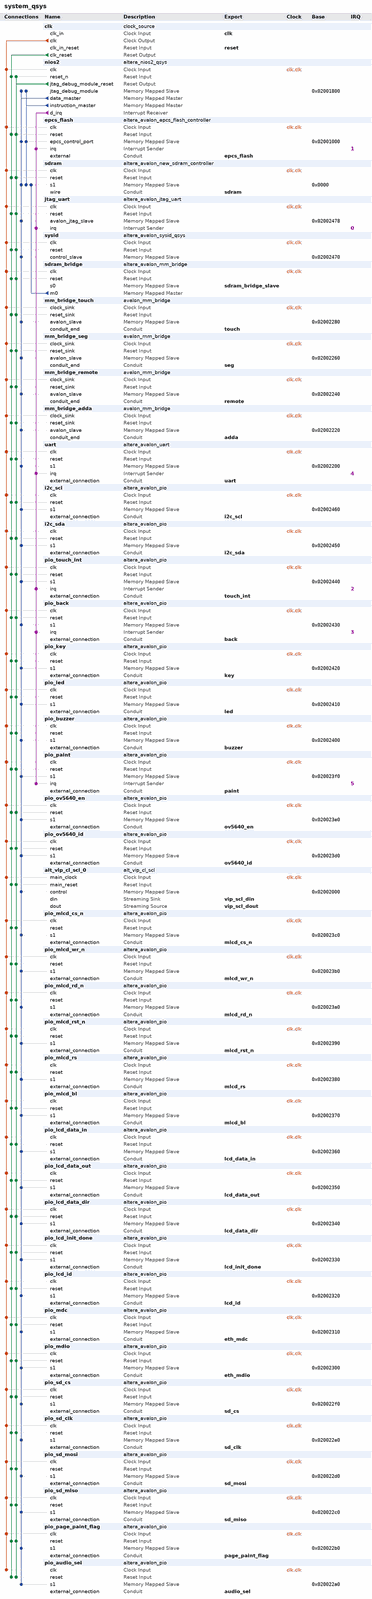
[diagram p0: system contents, whole]
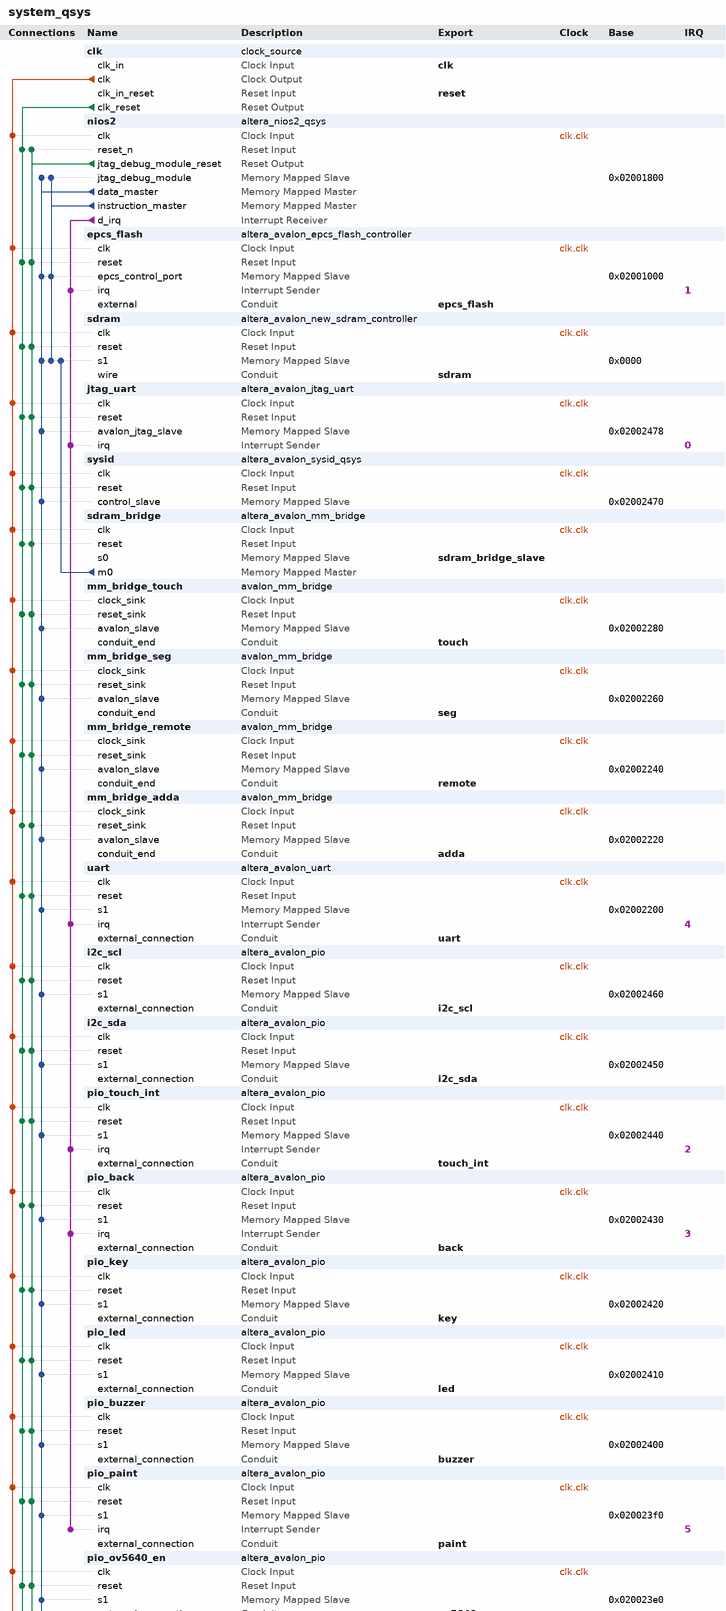
[diagram p1: system contents, upper part]
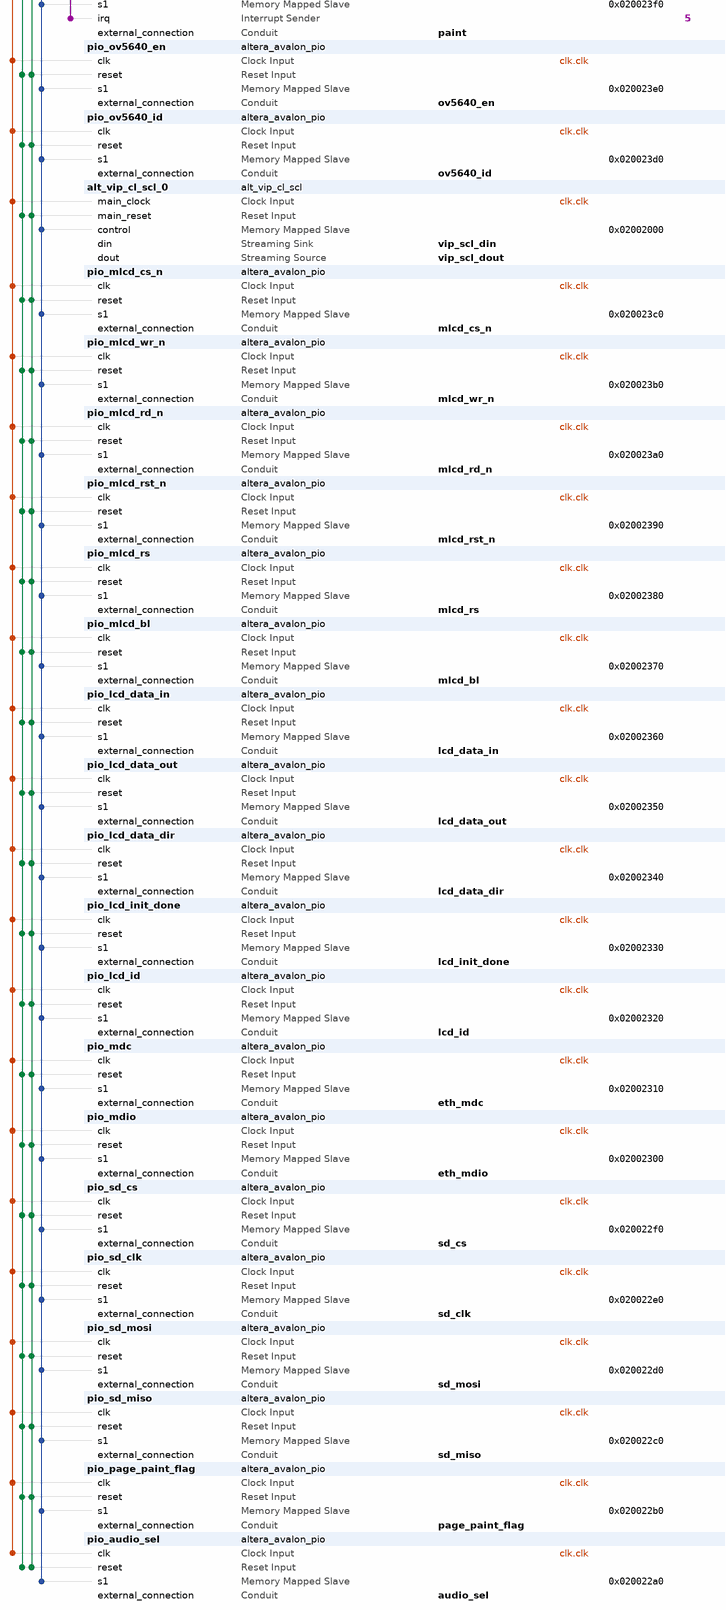
[diagram p2: system contents, lower part]
# Platform Designer (Qsys) system system_qsys, Cyclone IV E EP4CE10F17C8
# Parameters at their usual value, and those the tool derives, are not listed.
package require -exact qsys 13.1
create_system system_qsys
set_project_property DEVICE_FAMILY {Cyclone IV E}
set_project_property DEVICE EP4CE10F17C8

add_instance clk clock_source 13.1
set_instance_parameter_value clk clockFrequency 100000000

add_instance nios2 altera_nios2_qsys 13.1
set_instance_parameter_value nios2 resetSlave epcs_flash.epcs_control_port
set_instance_parameter_value nios2 mmu_TLBMissExcSlave None
set_instance_parameter_value nios2 exceptionSlave sdram.s1
set_instance_parameter_value nios2 breakSlave nios2.jtag_debug_module
set_instance_parameter_value nios2 impl Fast
set_instance_parameter_value nios2 icache_size 4096

add_instance epcs_flash altera_avalon_epcs_flash_controller 13.1

add_instance sdram altera_avalon_new_sdram_controller 13.1
set_instance_parameter_value sdram TAC 6.0
set_instance_parameter_value sdram TRCD 15.0
set_instance_parameter_value sdram TRFC 60.0
set_instance_parameter_value sdram TRP 15.0
set_instance_parameter_value sdram TWR 20.0
set_instance_parameter_value sdram casLatency 2
set_instance_parameter_value sdram columnWidth 9
set_instance_parameter_value sdram dataWidth 16
set_instance_parameter_value sdram generateSimulationModel false
set_instance_parameter_value sdram initRefreshCommands 8
set_instance_parameter_value sdram model single_Micron_MT48LC4M32B2_7_chip
set_instance_parameter_value sdram numberOfBanks 4
set_instance_parameter_value sdram numberOfChipSelects 1
set_instance_parameter_value sdram powerUpDelay 200.0
set_instance_parameter_value sdram refreshPeriod 7.8125
set_instance_parameter_value sdram rowWidth 13

add_instance jtag_uart altera_avalon_jtag_uart 13.1
set_instance_parameter_value jtag_uart simInteractiveOptions NO_INTERACTIVE_WINDOWS

add_instance sysid altera_avalon_sysid_qsys 13.1
set_instance_parameter_value sysid id 0

add_instance sdram_bridge altera_avalon_mm_bridge 13.1
set_instance_parameter_value sdram_bridge DATA_WIDTH 16
set_instance_parameter_value sdram_bridge ADDRESS_WIDTH 26
set_instance_parameter_value sdram_bridge ADDRESS_UNITS SYMBOLS
set_instance_parameter_value sdram_bridge MAX_BURST_SIZE 512
set_instance_parameter_value sdram_bridge MAX_PENDING_RESPONSES 4

add_instance mm_bridge_touch avalon_mm_bridge 1.0
set_instance_parameter_value mm_bridge_touch width 3

add_instance mm_bridge_seg avalon_mm_bridge 1.0
set_instance_parameter_value mm_bridge_seg width 3

add_instance mm_bridge_remote avalon_mm_bridge 1.0
set_instance_parameter_value mm_bridge_remote width 3

add_instance mm_bridge_adda avalon_mm_bridge 1.0
set_instance_parameter_value mm_bridge_adda width 3

add_instance uart altera_avalon_uart 13.1
set_instance_parameter_value uart baud 115200
set_instance_parameter_value uart dataBits 8
set_instance_parameter_value uart fixedBaud true
set_instance_parameter_value uart parity NONE
set_instance_parameter_value uart stopBits 1

add_instance i2c_scl altera_avalon_pio 13.1
set_instance_parameter_value i2c_scl direction Output
set_instance_parameter_value i2c_scl width 1

add_instance i2c_sda altera_avalon_pio 13.1
set_instance_parameter_value i2c_sda direction Bidir
set_instance_parameter_value i2c_sda width 1

add_instance pio_touch_int altera_avalon_pio 13.1
set_instance_parameter_value pio_touch_int bitClearingEdgeCapReg true
set_instance_parameter_value pio_touch_int captureEdge true
set_instance_parameter_value pio_touch_int direction Input
set_instance_parameter_value pio_touch_int edgeType FALLING
set_instance_parameter_value pio_touch_int generateIRQ true
set_instance_parameter_value pio_touch_int irqType EDGE
set_instance_parameter_value pio_touch_int width 1

add_instance pio_back altera_avalon_pio 13.1
set_instance_parameter_value pio_back bitClearingEdgeCapReg true
set_instance_parameter_value pio_back captureEdge true
set_instance_parameter_value pio_back direction Input
set_instance_parameter_value pio_back generateIRQ true
set_instance_parameter_value pio_back irqType EDGE
set_instance_parameter_value pio_back width 1

add_instance pio_key altera_avalon_pio 13.1
set_instance_parameter_value pio_key direction Input
set_instance_parameter_value pio_key width 4

add_instance pio_led altera_avalon_pio 13.1
set_instance_parameter_value pio_led direction Output
set_instance_parameter_value pio_led width 4

add_instance pio_buzzer altera_avalon_pio 13.1
set_instance_parameter_value pio_buzzer direction Output
set_instance_parameter_value pio_buzzer width 1

add_instance pio_paint altera_avalon_pio 13.1
set_instance_parameter_value pio_paint captureEdge true
set_instance_parameter_value pio_paint direction Input
set_instance_parameter_value pio_paint edgeType FALLING
set_instance_parameter_value pio_paint generateIRQ true
set_instance_parameter_value pio_paint irqType EDGE
set_instance_parameter_value pio_paint width 1

add_instance pio_ov5640_en altera_avalon_pio 13.1
set_instance_parameter_value pio_ov5640_en direction Output
set_instance_parameter_value pio_ov5640_en width 1

add_instance pio_ov5640_id altera_avalon_pio 13.1
set_instance_parameter_value pio_ov5640_id direction Input
set_instance_parameter_value pio_ov5640_id width 1

add_instance alt_vip_cl_scl_0 alt_vip_cl_scl 13.1
set_instance_parameter_value alt_vip_cl_scl_0 FAMILY {Cyclone IV E}
set_instance_parameter_value alt_vip_cl_scl_0 SYMBOLS_IN_SEQ 1
set_instance_parameter_value alt_vip_cl_scl_0 SYMBOLS_IN_PAR 3
set_instance_parameter_value alt_vip_cl_scl_0 BITS_PER_SYMBOL 8
set_instance_parameter_value alt_vip_cl_scl_0 EXTRA_PIPELINING 0
set_instance_parameter_value alt_vip_cl_scl_0 IS_422 0
set_instance_parameter_value alt_vip_cl_scl_0 NO_BLANKING 1
set_instance_parameter_value alt_vip_cl_scl_0 MAX_IN_WIDTH 800
set_instance_parameter_value alt_vip_cl_scl_0 MAX_IN_HEIGHT 480
set_instance_parameter_value alt_vip_cl_scl_0 MAX_OUT_WIDTH 1280
set_instance_parameter_value alt_vip_cl_scl_0 MAX_OUT_HEIGHT 800
set_instance_parameter_value alt_vip_cl_scl_0 RUNTIME_CONTROL 1
set_instance_parameter_value alt_vip_cl_scl_0 ALWAYS_DOWNSCALE 0
set_instance_parameter_value alt_vip_cl_scl_0 ALGORITHM_NAME NEAREST_NEIGHBOUR
set_instance_parameter_value alt_vip_cl_scl_0 DEFAULT_EDGE_THRESH 7
set_instance_parameter_value alt_vip_cl_scl_0 DEFAULT_UPPER_BLUR 15
set_instance_parameter_value alt_vip_cl_scl_0 DEFAULT_LOWER_BLUR 0
set_instance_parameter_value alt_vip_cl_scl_0 ENABLE_FIR 0
set_instance_parameter_value alt_vip_cl_scl_0 ARE_IDENTICAL 0
set_instance_parameter_value alt_vip_cl_scl_0 V_TAPS 8
set_instance_parameter_value alt_vip_cl_scl_0 V_PHASES 16
set_instance_parameter_value alt_vip_cl_scl_0 H_TAPS 8
set_instance_parameter_value alt_vip_cl_scl_0 H_PHASES 16
set_instance_parameter_value alt_vip_cl_scl_0 V_SIGNED 1
set_instance_parameter_value alt_vip_cl_scl_0 V_INTEGER_BITS 1
set_instance_parameter_value alt_vip_cl_scl_0 V_FRACTION_BITS 7
set_instance_parameter_value alt_vip_cl_scl_0 H_SIGNED 1
set_instance_parameter_value alt_vip_cl_scl_0 H_INTEGER_BITS 1
set_instance_parameter_value alt_vip_cl_scl_0 H_FRACTION_BITS 7
set_instance_parameter_value alt_vip_cl_scl_0 PRESERVE_BITS 0
set_instance_parameter_value alt_vip_cl_scl_0 LOAD_AT_RUNTIME 0
set_instance_parameter_value alt_vip_cl_scl_0 V_BANKS 1
set_instance_parameter_value alt_vip_cl_scl_0 V_SYMMETRIC 0
set_instance_parameter_value alt_vip_cl_scl_0 V_FUNCTION LANCZOS_2
set_instance_parameter_value alt_vip_cl_scl_0 V_COEFF_FILE {<enter file name (including full path)>}
set_instance_parameter_value alt_vip_cl_scl_0 H_BANKS 1
set_instance_parameter_value alt_vip_cl_scl_0 H_SYMMETRIC 0
set_instance_parameter_value alt_vip_cl_scl_0 H_FUNCTION LANCZOS_2
set_instance_parameter_value alt_vip_cl_scl_0 H_COEFF_FILE {<enter file name (including full path)>}
set_instance_parameter_value alt_vip_cl_scl_0 IS_420 0

add_instance pio_mlcd_cs_n altera_avalon_pio 13.1
set_instance_parameter_value pio_mlcd_cs_n direction Output
set_instance_parameter_value pio_mlcd_cs_n width 1

add_instance pio_mlcd_wr_n altera_avalon_pio 13.1
set_instance_parameter_value pio_mlcd_wr_n direction Output
set_instance_parameter_value pio_mlcd_wr_n width 1

add_instance pio_mlcd_rd_n altera_avalon_pio 13.1
set_instance_parameter_value pio_mlcd_rd_n direction Output
set_instance_parameter_value pio_mlcd_rd_n width 1

add_instance pio_mlcd_rst_n altera_avalon_pio 13.1
set_instance_parameter_value pio_mlcd_rst_n direction Output
set_instance_parameter_value pio_mlcd_rst_n width 1

add_instance pio_mlcd_rs altera_avalon_pio 13.1
set_instance_parameter_value pio_mlcd_rs direction Output
set_instance_parameter_value pio_mlcd_rs width 1

add_instance pio_mlcd_bl altera_avalon_pio 13.1
set_instance_parameter_value pio_mlcd_bl direction Output
set_instance_parameter_value pio_mlcd_bl width 1

add_instance pio_lcd_data_in altera_avalon_pio 13.1
set_instance_parameter_value pio_lcd_data_in direction Input
set_instance_parameter_value pio_lcd_data_in width 16

add_instance pio_lcd_data_out altera_avalon_pio 13.1
set_instance_parameter_value pio_lcd_data_out direction Output
set_instance_parameter_value pio_lcd_data_out width 16

add_instance pio_lcd_data_dir altera_avalon_pio 13.1
set_instance_parameter_value pio_lcd_data_dir direction Output
set_instance_parameter_value pio_lcd_data_dir width 1

add_instance pio_lcd_init_done altera_avalon_pio 13.1
set_instance_parameter_value pio_lcd_init_done direction Output
set_instance_parameter_value pio_lcd_init_done width 1

add_instance pio_lcd_id altera_avalon_pio 13.1
set_instance_parameter_value pio_lcd_id direction Output
set_instance_parameter_value pio_lcd_id width 16

add_instance pio_mdc altera_avalon_pio 13.1
set_instance_parameter_value pio_mdc direction Output
set_instance_parameter_value pio_mdc width 1

add_instance pio_mdio altera_avalon_pio 13.1
set_instance_parameter_value pio_mdio direction Bidir
set_instance_parameter_value pio_mdio width 1

add_instance pio_sd_cs altera_avalon_pio 13.1
set_instance_parameter_value pio_sd_cs direction Output
set_instance_parameter_value pio_sd_cs resetValue 1
set_instance_parameter_value pio_sd_cs width 1

add_instance pio_sd_clk altera_avalon_pio 13.1
set_instance_parameter_value pio_sd_clk direction Output
set_instance_parameter_value pio_sd_clk resetValue 1
set_instance_parameter_value pio_sd_clk width 1

add_instance pio_sd_mosi altera_avalon_pio 13.1
set_instance_parameter_value pio_sd_mosi direction Output
set_instance_parameter_value pio_sd_mosi resetValue 1
set_instance_parameter_value pio_sd_mosi width 1

add_instance pio_sd_miso altera_avalon_pio 13.1
set_instance_parameter_value pio_sd_miso direction Input
set_instance_parameter_value pio_sd_miso width 1

add_instance pio_page_paint_flag altera_avalon_pio 13.1
set_instance_parameter_value pio_page_paint_flag direction Output
set_instance_parameter_value pio_page_paint_flag width 1

add_instance pio_audio_sel altera_avalon_pio 13.1
set_instance_parameter_value pio_audio_sel direction Output
set_instance_parameter_value pio_audio_sel width 1

# connections
add_connection clk.clk alt_vip_cl_scl_0.main_clock clock
add_connection clk.clk epcs_flash.clk clock
add_connection clk.clk i2c_scl.clk clock
add_connection clk.clk i2c_sda.clk clock
add_connection clk.clk jtag_uart.clk clock
add_connection clk.clk mm_bridge_adda.clock_sink clock
add_connection clk.clk mm_bridge_remote.clock_sink clock
add_connection clk.clk mm_bridge_seg.clock_sink clock
add_connection clk.clk mm_bridge_touch.clock_sink clock
add_connection clk.clk nios2.clk clock
add_connection clk.clk pio_audio_sel.clk clock
add_connection clk.clk pio_back.clk clock
add_connection clk.clk pio_buzzer.clk clock
add_connection clk.clk pio_key.clk clock
add_connection clk.clk pio_lcd_data_dir.clk clock
add_connection clk.clk pio_lcd_data_in.clk clock
add_connection clk.clk pio_lcd_data_out.clk clock
add_connection clk.clk pio_lcd_id.clk clock
add_connection clk.clk pio_lcd_init_done.clk clock
add_connection clk.clk pio_led.clk clock
add_connection clk.clk pio_mdc.clk clock
add_connection clk.clk pio_mdio.clk clock
add_connection clk.clk pio_mlcd_bl.clk clock
add_connection clk.clk pio_mlcd_cs_n.clk clock
add_connection clk.clk pio_mlcd_rd_n.clk clock
add_connection clk.clk pio_mlcd_rs.clk clock
add_connection clk.clk pio_mlcd_rst_n.clk clock
add_connection clk.clk pio_mlcd_wr_n.clk clock
add_connection clk.clk pio_ov5640_en.clk clock
add_connection clk.clk pio_ov5640_id.clk clock
add_connection clk.clk pio_page_paint_flag.clk clock
add_connection clk.clk pio_paint.clk clock
add_connection clk.clk pio_sd_clk.clk clock
add_connection clk.clk pio_sd_cs.clk clock
add_connection clk.clk pio_sd_miso.clk clock
add_connection clk.clk pio_sd_mosi.clk clock
add_connection clk.clk pio_touch_int.clk clock
add_connection clk.clk sdram.clk clock
add_connection clk.clk sdram_bridge.clk clock
add_connection clk.clk sysid.clk clock
add_connection clk.clk uart.clk clock
add_connection clk.clk_reset alt_vip_cl_scl_0.main_reset reset
add_connection clk.clk_reset epcs_flash.reset reset
add_connection clk.clk_reset i2c_scl.reset reset
add_connection clk.clk_reset i2c_sda.reset reset
add_connection clk.clk_reset jtag_uart.reset reset
add_connection clk.clk_reset mm_bridge_adda.reset_sink reset
add_connection clk.clk_reset mm_bridge_remote.reset_sink reset
add_connection clk.clk_reset mm_bridge_seg.reset_sink reset
add_connection clk.clk_reset mm_bridge_touch.reset_sink reset
add_connection clk.clk_reset nios2.reset_n reset
add_connection clk.clk_reset pio_audio_sel.reset reset
add_connection clk.clk_reset pio_back.reset reset
add_connection clk.clk_reset pio_buzzer.reset reset
add_connection clk.clk_reset pio_key.reset reset
add_connection clk.clk_reset pio_lcd_data_dir.reset reset
add_connection clk.clk_reset pio_lcd_data_in.reset reset
add_connection clk.clk_reset pio_lcd_data_out.reset reset
add_connection clk.clk_reset pio_lcd_id.reset reset
add_connection clk.clk_reset pio_lcd_init_done.reset reset
add_connection clk.clk_reset pio_led.reset reset
add_connection clk.clk_reset pio_mdc.reset reset
add_connection clk.clk_reset pio_mdio.reset reset
add_connection clk.clk_reset pio_mlcd_bl.reset reset
add_connection clk.clk_reset pio_mlcd_cs_n.reset reset
add_connection clk.clk_reset pio_mlcd_rd_n.reset reset
add_connection clk.clk_reset pio_mlcd_rs.reset reset
add_connection clk.clk_reset pio_mlcd_rst_n.reset reset
add_connection clk.clk_reset pio_mlcd_wr_n.reset reset
add_connection clk.clk_reset pio_ov5640_en.reset reset
add_connection clk.clk_reset pio_ov5640_id.reset reset
add_connection clk.clk_reset pio_page_paint_flag.reset reset
add_connection clk.clk_reset pio_paint.reset reset
add_connection clk.clk_reset pio_sd_clk.reset reset
add_connection clk.clk_reset pio_sd_cs.reset reset
add_connection clk.clk_reset pio_sd_miso.reset reset
add_connection clk.clk_reset pio_sd_mosi.reset reset
add_connection clk.clk_reset pio_touch_int.reset reset
add_connection clk.clk_reset sdram.reset reset
add_connection clk.clk_reset sdram_bridge.reset reset
add_connection clk.clk_reset sysid.reset reset
add_connection clk.clk_reset uart.reset reset
add_connection nios2.jtag_debug_module_reset alt_vip_cl_scl_0.main_reset reset
add_connection nios2.jtag_debug_module_reset epcs_flash.reset reset
add_connection nios2.jtag_debug_module_reset i2c_scl.reset reset
add_connection nios2.jtag_debug_module_reset i2c_sda.reset reset
add_connection nios2.jtag_debug_module_reset jtag_uart.reset reset
add_connection nios2.jtag_debug_module_reset mm_bridge_adda.reset_sink reset
add_connection nios2.jtag_debug_module_reset mm_bridge_remote.reset_sink reset
add_connection nios2.jtag_debug_module_reset mm_bridge_seg.reset_sink reset
add_connection nios2.jtag_debug_module_reset mm_bridge_touch.reset_sink reset
add_connection nios2.jtag_debug_module_reset nios2.reset_n reset
add_connection nios2.jtag_debug_module_reset pio_audio_sel.reset reset
add_connection nios2.jtag_debug_module_reset pio_back.reset reset
add_connection nios2.jtag_debug_module_reset pio_buzzer.reset reset
add_connection nios2.jtag_debug_module_reset pio_key.reset reset
add_connection nios2.jtag_debug_module_reset pio_lcd_data_dir.reset reset
add_connection nios2.jtag_debug_module_reset pio_lcd_data_in.reset reset
add_connection nios2.jtag_debug_module_reset pio_lcd_data_out.reset reset
add_connection nios2.jtag_debug_module_reset pio_lcd_id.reset reset
add_connection nios2.jtag_debug_module_reset pio_lcd_init_done.reset reset
add_connection nios2.jtag_debug_module_reset pio_led.reset reset
add_connection nios2.jtag_debug_module_reset pio_mdc.reset reset
add_connection nios2.jtag_debug_module_reset pio_mdio.reset reset
add_connection nios2.jtag_debug_module_reset pio_mlcd_bl.reset reset
add_connection nios2.jtag_debug_module_reset pio_mlcd_cs_n.reset reset
add_connection nios2.jtag_debug_module_reset pio_mlcd_rd_n.reset reset
add_connection nios2.jtag_debug_module_reset pio_mlcd_rs.reset reset
add_connection nios2.jtag_debug_module_reset pio_mlcd_rst_n.reset reset
add_connection nios2.jtag_debug_module_reset pio_mlcd_wr_n.reset reset
add_connection nios2.jtag_debug_module_reset pio_ov5640_en.reset reset
add_connection nios2.jtag_debug_module_reset pio_ov5640_id.reset reset
add_connection nios2.jtag_debug_module_reset pio_page_paint_flag.reset reset
add_connection nios2.jtag_debug_module_reset pio_paint.reset reset
add_connection nios2.jtag_debug_module_reset pio_sd_clk.reset reset
add_connection nios2.jtag_debug_module_reset pio_sd_cs.reset reset
add_connection nios2.jtag_debug_module_reset pio_sd_miso.reset reset
add_connection nios2.jtag_debug_module_reset pio_sd_mosi.reset reset
add_connection nios2.jtag_debug_module_reset pio_touch_int.reset reset
add_connection nios2.jtag_debug_module_reset sdram.reset reset
add_connection nios2.jtag_debug_module_reset sdram_bridge.reset reset
add_connection nios2.jtag_debug_module_reset sysid.reset reset
add_connection nios2.jtag_debug_module_reset uart.reset reset
add_connection nios2.data_master alt_vip_cl_scl_0.control avalon
set_connection_parameter_value nios2.data_master/alt_vip_cl_scl_0.control baseAddress 0x02002000
add_connection nios2.data_master epcs_flash.epcs_control_port avalon
set_connection_parameter_value nios2.data_master/epcs_flash.epcs_control_port baseAddress 0x02001000
add_connection nios2.data_master i2c_scl.s1 avalon
set_connection_parameter_value nios2.data_master/i2c_scl.s1 baseAddress 0x02002460
add_connection nios2.data_master i2c_sda.s1 avalon
set_connection_parameter_value nios2.data_master/i2c_sda.s1 baseAddress 0x02002450
add_connection nios2.data_master jtag_uart.avalon_jtag_slave avalon
set_connection_parameter_value nios2.data_master/jtag_uart.avalon_jtag_slave baseAddress 0x02002478
add_connection nios2.data_master mm_bridge_adda.avalon_slave avalon
set_connection_parameter_value nios2.data_master/mm_bridge_adda.avalon_slave baseAddress 0x02002220
add_connection nios2.data_master mm_bridge_remote.avalon_slave avalon
set_connection_parameter_value nios2.data_master/mm_bridge_remote.avalon_slave baseAddress 0x02002240
add_connection nios2.data_master mm_bridge_seg.avalon_slave avalon
set_connection_parameter_value nios2.data_master/mm_bridge_seg.avalon_slave baseAddress 0x02002260
add_connection nios2.data_master mm_bridge_touch.avalon_slave avalon
set_connection_parameter_value nios2.data_master/mm_bridge_touch.avalon_slave baseAddress 0x02002280
add_connection nios2.data_master nios2.jtag_debug_module avalon
set_connection_parameter_value nios2.data_master/nios2.jtag_debug_module baseAddress 0x02001800
add_connection nios2.data_master pio_audio_sel.s1 avalon
set_connection_parameter_value nios2.data_master/pio_audio_sel.s1 baseAddress 0x020022a0
add_connection nios2.data_master pio_back.s1 avalon
set_connection_parameter_value nios2.data_master/pio_back.s1 baseAddress 0x02002430
add_connection nios2.data_master pio_buzzer.s1 avalon
set_connection_parameter_value nios2.data_master/pio_buzzer.s1 baseAddress 0x02002400
add_connection nios2.data_master pio_key.s1 avalon
set_connection_parameter_value nios2.data_master/pio_key.s1 baseAddress 0x02002420
add_connection nios2.data_master pio_lcd_data_dir.s1 avalon
set_connection_parameter_value nios2.data_master/pio_lcd_data_dir.s1 baseAddress 0x02002340
add_connection nios2.data_master pio_lcd_data_in.s1 avalon
set_connection_parameter_value nios2.data_master/pio_lcd_data_in.s1 baseAddress 0x02002360
add_connection nios2.data_master pio_lcd_data_out.s1 avalon
set_connection_parameter_value nios2.data_master/pio_lcd_data_out.s1 baseAddress 0x02002350
add_connection nios2.data_master pio_lcd_id.s1 avalon
set_connection_parameter_value nios2.data_master/pio_lcd_id.s1 baseAddress 0x02002320
add_connection nios2.data_master pio_lcd_init_done.s1 avalon
set_connection_parameter_value nios2.data_master/pio_lcd_init_done.s1 baseAddress 0x02002330
add_connection nios2.data_master pio_led.s1 avalon
set_connection_parameter_value nios2.data_master/pio_led.s1 baseAddress 0x02002410
add_connection nios2.data_master pio_mdc.s1 avalon
set_connection_parameter_value nios2.data_master/pio_mdc.s1 baseAddress 0x02002310
add_connection nios2.data_master pio_mdio.s1 avalon
set_connection_parameter_value nios2.data_master/pio_mdio.s1 baseAddress 0x02002300
add_connection nios2.data_master pio_mlcd_bl.s1 avalon
set_connection_parameter_value nios2.data_master/pio_mlcd_bl.s1 baseAddress 0x02002370
add_connection nios2.data_master pio_mlcd_cs_n.s1 avalon
set_connection_parameter_value nios2.data_master/pio_mlcd_cs_n.s1 baseAddress 0x020023c0
add_connection nios2.data_master pio_mlcd_rd_n.s1 avalon
set_connection_parameter_value nios2.data_master/pio_mlcd_rd_n.s1 baseAddress 0x020023a0
add_connection nios2.data_master pio_mlcd_rs.s1 avalon
set_connection_parameter_value nios2.data_master/pio_mlcd_rs.s1 baseAddress 0x02002380
add_connection nios2.data_master pio_mlcd_rst_n.s1 avalon
set_connection_parameter_value nios2.data_master/pio_mlcd_rst_n.s1 baseAddress 0x02002390
add_connection nios2.data_master pio_mlcd_wr_n.s1 avalon
set_connection_parameter_value nios2.data_master/pio_mlcd_wr_n.s1 baseAddress 0x020023b0
add_connection nios2.data_master pio_ov5640_en.s1 avalon
set_connection_parameter_value nios2.data_master/pio_ov5640_en.s1 baseAddress 0x020023e0
add_connection nios2.data_master pio_ov5640_id.s1 avalon
set_connection_parameter_value nios2.data_master/pio_ov5640_id.s1 baseAddress 0x020023d0
add_connection nios2.data_master pio_page_paint_flag.s1 avalon
set_connection_parameter_value nios2.data_master/pio_page_paint_flag.s1 baseAddress 0x020022b0
add_connection nios2.data_master pio_paint.s1 avalon
set_connection_parameter_value nios2.data_master/pio_paint.s1 baseAddress 0x020023f0
add_connection nios2.data_master pio_sd_clk.s1 avalon
set_connection_parameter_value nios2.data_master/pio_sd_clk.s1 baseAddress 0x020022e0
add_connection nios2.data_master pio_sd_cs.s1 avalon
set_connection_parameter_value nios2.data_master/pio_sd_cs.s1 baseAddress 0x020022f0
add_connection nios2.data_master pio_sd_miso.s1 avalon
set_connection_parameter_value nios2.data_master/pio_sd_miso.s1 baseAddress 0x020022c0
add_connection nios2.data_master pio_sd_mosi.s1 avalon
set_connection_parameter_value nios2.data_master/pio_sd_mosi.s1 baseAddress 0x020022d0
add_connection nios2.data_master pio_touch_int.s1 avalon
set_connection_parameter_value nios2.data_master/pio_touch_int.s1 baseAddress 0x02002440
add_connection nios2.data_master sdram.s1 avalon
set_connection_parameter_value nios2.data_master/sdram.s1 baseAddress 0x0000
add_connection nios2.data_master sysid.control_slave avalon
set_connection_parameter_value nios2.data_master/sysid.control_slave baseAddress 0x02002470
add_connection nios2.data_master uart.s1 avalon
set_connection_parameter_value nios2.data_master/uart.s1 baseAddress 0x02002200
add_connection nios2.instruction_master epcs_flash.epcs_control_port avalon
set_connection_parameter_value nios2.instruction_master/epcs_flash.epcs_control_port baseAddress 0x02001000
add_connection nios2.instruction_master nios2.jtag_debug_module avalon
set_connection_parameter_value nios2.instruction_master/nios2.jtag_debug_module baseAddress 0x02001800
add_connection nios2.instruction_master sdram.s1 avalon
set_connection_parameter_value nios2.instruction_master/sdram.s1 baseAddress 0x0000
add_connection sdram_bridge.m0 sdram.s1 avalon
set_connection_parameter_value sdram_bridge.m0/sdram.s1 baseAddress 0x0000
add_connection nios2.d_irq epcs_flash.irq interrupt
set_connection_parameter_value nios2.d_irq/epcs_flash.irq irqNumber 1
add_connection nios2.d_irq jtag_uart.irq interrupt
set_connection_parameter_value nios2.d_irq/jtag_uart.irq irqNumber 0
add_connection nios2.d_irq pio_back.irq interrupt
set_connection_parameter_value nios2.d_irq/pio_back.irq irqNumber 3
add_connection nios2.d_irq pio_paint.irq interrupt
set_connection_parameter_value nios2.d_irq/pio_paint.irq irqNumber 5
add_connection nios2.d_irq pio_touch_int.irq interrupt
set_connection_parameter_value nios2.d_irq/pio_touch_int.irq irqNumber 2
add_connection nios2.d_irq uart.irq interrupt
set_connection_parameter_value nios2.d_irq/uart.irq irqNumber 4

# exported interfaces
add_interface clk clock sink
set_interface_property clk EXPORT_OF clk.clk_in
add_interface reset reset sink
set_interface_property reset EXPORT_OF clk.clk_in_reset
add_interface touch conduit end
set_interface_property touch EXPORT_OF mm_bridge_touch.conduit_end
add_interface seg conduit end
set_interface_property seg EXPORT_OF mm_bridge_seg.conduit_end
add_interface remote conduit end
set_interface_property remote EXPORT_OF mm_bridge_remote.conduit_end
add_interface adda conduit end
set_interface_property adda EXPORT_OF mm_bridge_adda.conduit_end
add_interface touch_int conduit end
set_interface_property touch_int EXPORT_OF pio_touch_int.external_connection
add_interface back conduit end
set_interface_property back EXPORT_OF pio_back.external_connection
add_interface key conduit end
set_interface_property key EXPORT_OF pio_key.external_connection
add_interface led conduit end
set_interface_property led EXPORT_OF pio_led.external_connection
add_interface buzzer conduit end
set_interface_property buzzer EXPORT_OF pio_buzzer.external_connection
add_interface uart conduit end
set_interface_property uart EXPORT_OF uart.external_connection
add_interface i2c_scl conduit end
set_interface_property i2c_scl EXPORT_OF i2c_scl.external_connection
add_interface i2c_sda conduit end
set_interface_property i2c_sda EXPORT_OF i2c_sda.external_connection
add_interface paint conduit end
set_interface_property paint EXPORT_OF pio_paint.external_connection
add_interface ov5640_en conduit end
set_interface_property ov5640_en EXPORT_OF pio_ov5640_en.external_connection
add_interface ov5640_id conduit end
set_interface_property ov5640_id EXPORT_OF pio_ov5640_id.external_connection
add_interface epcs_flash conduit end
set_interface_property epcs_flash EXPORT_OF epcs_flash.external
add_interface sdram conduit end
set_interface_property sdram EXPORT_OF sdram.wire
add_interface sdram_bridge_slave avalon slave
set_interface_property sdram_bridge_slave EXPORT_OF sdram_bridge.s0
add_interface vip_scl_din avalon_streaming sink
set_interface_property vip_scl_din EXPORT_OF alt_vip_cl_scl_0.din
add_interface vip_scl_dout avalon_streaming source
set_interface_property vip_scl_dout EXPORT_OF alt_vip_cl_scl_0.dout
add_interface mlcd_cs_n conduit end
set_interface_property mlcd_cs_n EXPORT_OF pio_mlcd_cs_n.external_connection
add_interface mlcd_wr_n conduit end
set_interface_property mlcd_wr_n EXPORT_OF pio_mlcd_wr_n.external_connection
add_interface mlcd_rd_n conduit end
set_interface_property mlcd_rd_n EXPORT_OF pio_mlcd_rd_n.external_connection
add_interface mlcd_rst_n conduit end
set_interface_property mlcd_rst_n EXPORT_OF pio_mlcd_rst_n.external_connection
add_interface mlcd_rs conduit end
set_interface_property mlcd_rs EXPORT_OF pio_mlcd_rs.external_connection
add_interface mlcd_bl conduit end
set_interface_property mlcd_bl EXPORT_OF pio_mlcd_bl.external_connection
add_interface lcd_data_in conduit end
set_interface_property lcd_data_in EXPORT_OF pio_lcd_data_in.external_connection
add_interface lcd_data_out conduit end
set_interface_property lcd_data_out EXPORT_OF pio_lcd_data_out.external_connection
add_interface lcd_data_dir conduit end
set_interface_property lcd_data_dir EXPORT_OF pio_lcd_data_dir.external_connection
add_interface lcd_init_done conduit end
set_interface_property lcd_init_done EXPORT_OF pio_lcd_init_done.external_connection
add_interface lcd_id conduit end
set_interface_property lcd_id EXPORT_OF pio_lcd_id.external_connection
add_interface eth_mdc conduit end
set_interface_property eth_mdc EXPORT_OF pio_mdc.external_connection
add_interface eth_mdio conduit end
set_interface_property eth_mdio EXPORT_OF pio_mdio.external_connection
add_interface sd_cs conduit end
set_interface_property sd_cs EXPORT_OF pio_sd_cs.external_connection
add_interface sd_clk conduit end
set_interface_property sd_clk EXPORT_OF pio_sd_clk.external_connection
add_interface sd_mosi conduit end
set_interface_property sd_mosi EXPORT_OF pio_sd_mosi.external_connection
add_interface sd_miso conduit end
set_interface_property sd_miso EXPORT_OF pio_sd_miso.external_connection
add_interface page_paint_flag conduit end
set_interface_property page_paint_flag EXPORT_OF pio_page_paint_flag.external_connection
add_interface audio_sel conduit end
set_interface_property audio_sel EXPORT_OF pio_audio_sel.external_connection

set_interconnect_requirement {$system} qsys_mm.clockCrossingAdapter HANDSHAKE
set_interconnect_requirement {$system} qsys_mm.maxAdditionalLatency 1
set_interconnect_requirement {$system} qsys_mm.insertDefaultSlave false

save_system system_qsys.qsys
